# EAGLE design ESP_Module_No_Battery (EAGLE 9.2.0)
COMPANY: ADAFRUIT INDUSTRIES; DRAWN: KTOWN; REV: B
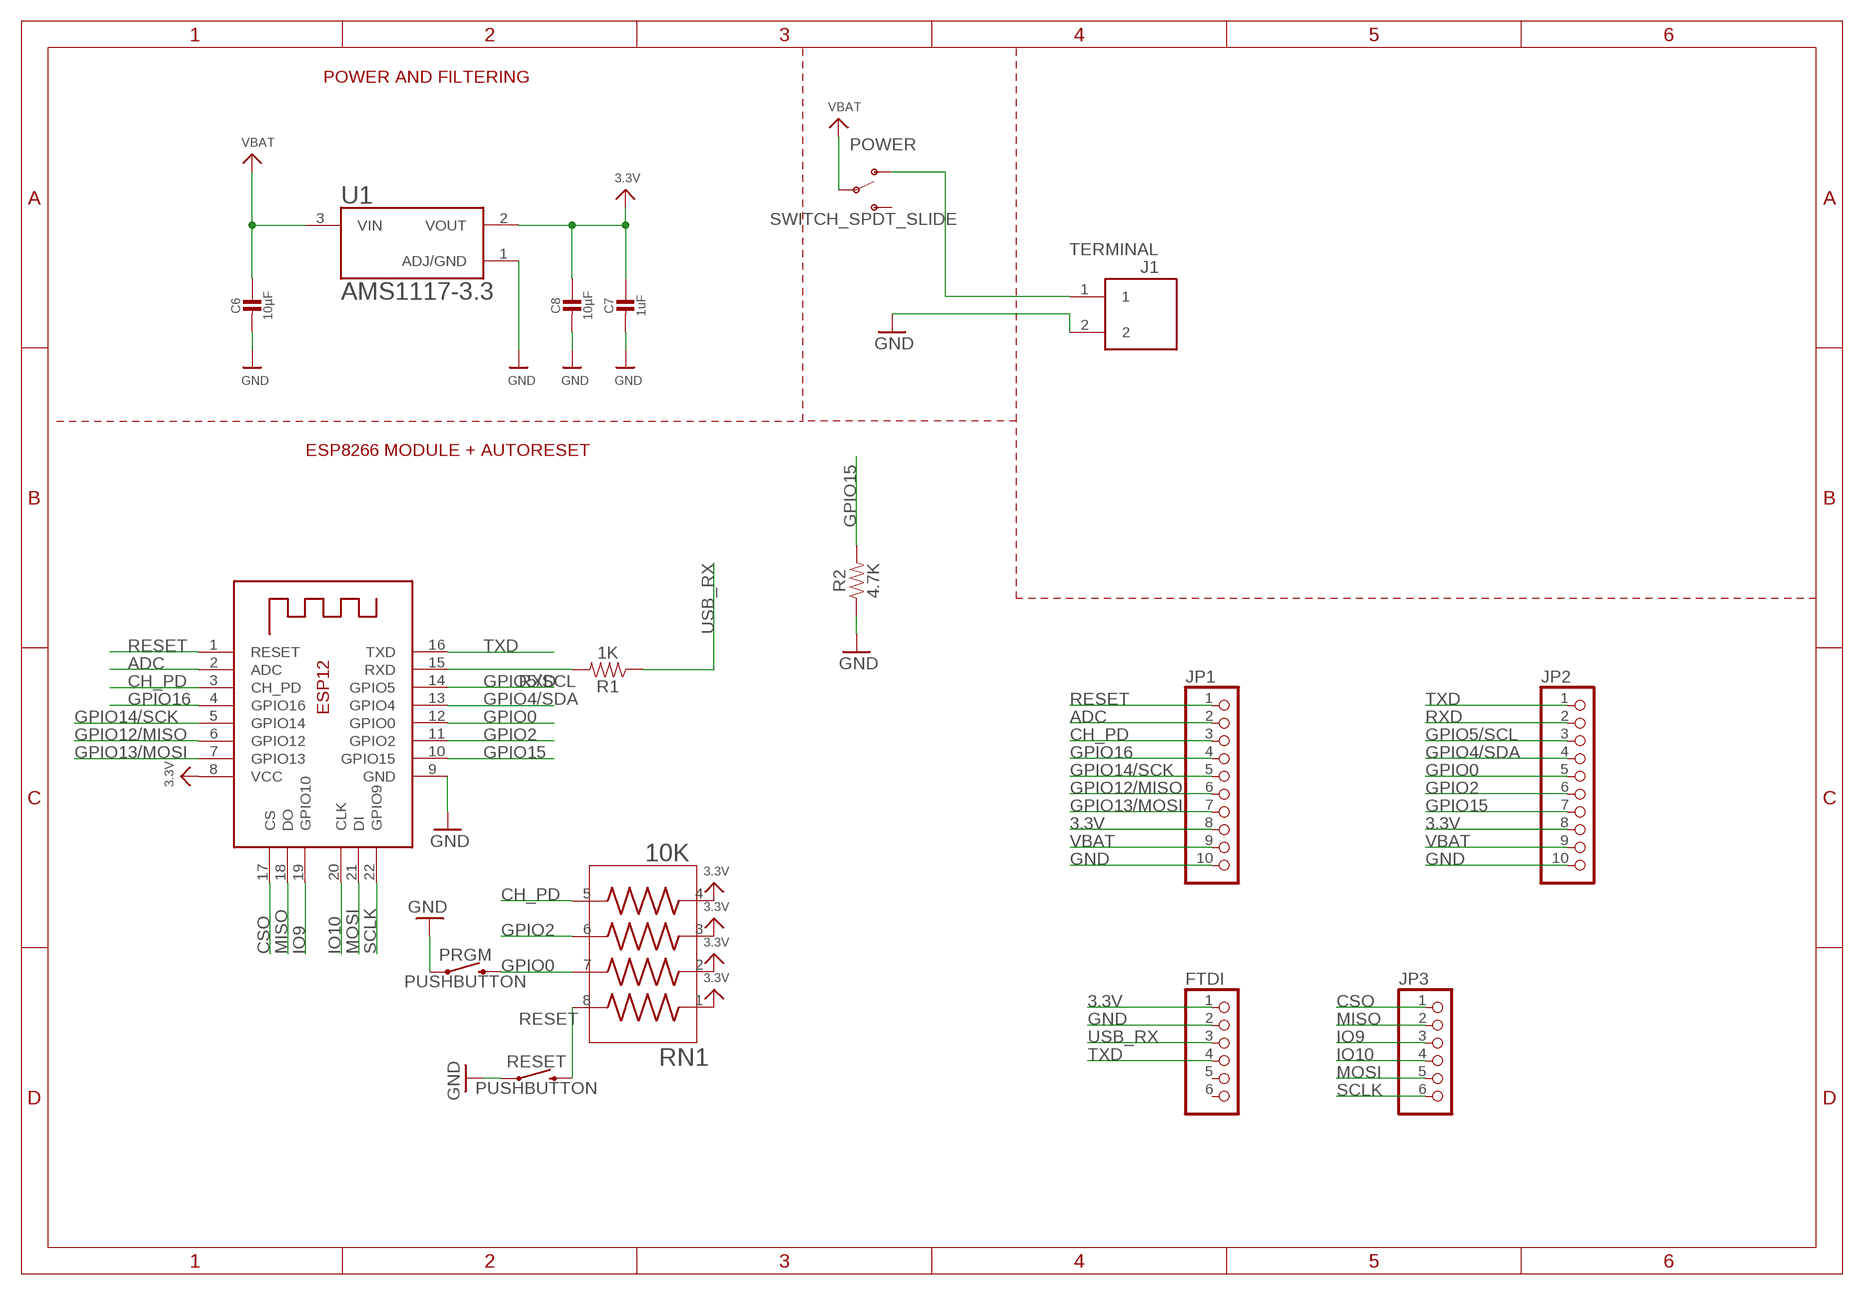
[diagram p0: schematic, sheet 1]

## Parts
C6  10µF  CAP_CERAMIC0805-NOOUTLINE  [0805-NO]
C7  1uF  CAP_CERAMIC0603_NO  [0603-NO]
C8  10µF  CAP_CERAMIC0805-NOOUTLINE  [0805-NO]
FTDI  PINHD-1X6  [1X06]
J1  TERMINAL  [ED555/2DS]
JP1  PINHD-1X10  [1X10]
JP2  PINHD-1X10  [1X10]
JP3  PINHD-1X6  [1X06]
POWER  SWITCH_SPDT_SLIDE  [SWITCH_SPDT_PTH_11.6X4.0MM]
PRGM  PUSHBUTTON  [TACTILE_SWITCH_SMD_6.0X3.5MM]
R1  1K  RESISTOR1206  [1206]
R2  4.7K  RESISTOR1206  [1206]
RESET  PUSHBUTTON  [TACTILE_SWITCH_SMD_6.0X3.5MM]
RN1  10K  CAY16-750J4LF  [RESCAF80P320X160X60-8N]
U1  AMS1117-3.3  [SOT229P700X180-4N]
X2  ESP-12  ESP-12E  [ESP-12E]

## Nets
3.3V: C7.1 C8.1 FTDI.1 JP1.8 JP2.8 RN1.1 RN1.2 RN1.3 RN1.4 U1.2(VOUT) X2.8(VCC)
ADC: JP1.2 X2.2(ADC)
CH_PD: JP1.3 RN1.5 X2.3(CH_PD)
CSO: JP3.1 X2.17(CS)
GND: C6.2 C7.2 C8.2 FTDI.2 J1.2 JP1.10 JP2.10 PRGM.1 R2.1 RESET.1 U1.1(ADJ/GND) X2.9(GND)
GPIO0: JP2.5 PRGM.2 RN1.7 X2.12(GPIO0)
GPIO2: JP2.6 RN1.6 X2.11(GPIO2)
GPIO4/SDA: JP2.4 X2.13(GPIO4)
GPIO5/SCL: JP2.3 X2.14(GPIO5)
GPIO12/MISO: JP1.6 X2.6(GPIO12)
GPIO13/MOSI: JP1.7 X2.7(GPIO13)
GPIO14/SCK: JP1.5 X2.5(GPIO14)
GPIO15: JP2.7 R2.2 X2.10(GPIO15)
GPIO16: JP1.4 X2.4(GPIO16)
IO9: JP3.3 X2.19(GPIO10)
IO10: JP3.4 X2.20(CLK)
MISO: JP3.2 X2.18(DO)
MOSI: JP3.5 X2.21(DI)
N$1: J1.1 POWER.1(O)
RESET: JP1.1 RESET.2 RN1.8 X2.1(RESET)
RXD: JP2.2 R1.2 X2.15(RXD)
SCLK: JP3.6 X2.22(GPIO9)
TXD: FTDI.4 JP2.1 X2.16(TXD)
USB_RX: FTDI.3 R1.1
VBAT: C6.1 JP1.9 JP2.9 POWER.2(P) U1.3(VIN)
Unconnected: FTDI.5 FTDI.6 POWER.3(S)

## Notes on the sheet
- POWER AND FILTERING
- ESP8266 MODULE + AUTORESET

## Library data of the parts
C6-C8 = microbuilder:CAP_CERAMIC: Ceramic Capacitors For new designs, use the packages preceded by an '_' character since they are more reliable: The following footprints should be used on most boards: _0402 - Standard footprint for regular board layouts _0603 - Standard footprint for regular board layouts _0805 - Standard footprint for regular board layouts _1206 - Standard footprint for regular board layouts For extremely tight-pitch boards where space is at a premium, the following 'micro-pitch' footprints can be used (smaller pads, no silkscreen outline, etc.): _0402MP - Micro-pitch footprint for very dense/compact boards _0603MP - Micro-pitch footprint for very dense/compact boards _0805MP - Micro-pitch footprint for very dense/compact boards _1206MP - Micro-pitch footprint for very dense/compact boards
FTDI JP3 = pinhead:PINHD-1X6: PIN HEADER
J1 = AutoPark:TERMINAL: 2-Pin Terminal Block 3.5mm pitch 6A
JP1 JP2 = pinhead:PINHD-1X10: PIN HEADER
POWER = AutoPark:SWITCH_SPDT_SLIDE: 拨动开关SK12D07VG2/3/4/5/6 侧面5脚拨动带支架 3脚2档柄高6MM Taobao <https://item.taobao.com/item.htm?spm=a1z09.2.0.0.53a62e8d0RVocC&id=563254128682&_u=s1po4ce26496> Dimensional Drawing <https://img.alicdn.com/imgextra/i1/2744920356/TB2568GkMDD8KJjy0FdXXcjvXXa_!!2744920356.jpg>
PRGM RESET = AutoPark:PUSHBUTTON
R1 R2 = SparkFun-Resistors:RESISTOR: Generic Resistor Package
RN1 = AutoPark:CAY16-750J4LF: Res Thick Film Array 75 Ohm 5% 0.25W(1/4W) ?200ppm/C ISOL Molded 8-Pin 1206(4 X 0603) Convex SMD T/R; AVAILABILITY: Unavailable; DESCRIPTION: Res Thick Film Array 75 Ohm 5% 0.25W_1/4W_ ?200ppm/C ISOL Molded 8-Pin 1206_4 X 0603_ Convex SMD T/R; MF: Bourns; MP: CAY16-750J4LF; PACKAGE: 1206 Bourns; PRICE: None
U1 = AutoPark:AMS1117-3.3: Sot223/Pkg 1-Amp 3.3-Volt Low Drop Out Voltage Regulatator; AVAILABILITY: Unavailable; DESCRIPTION: Sot223/Pkg 1-Amp 3.3-Volt Low Drop Out Voltage Regulatator; MF: Advanced Monolithic Systems; MP: AMS1117-3.3; PACKAGE: None; PRICE: None
X2 = microbuilder:ESP-12E

## Board
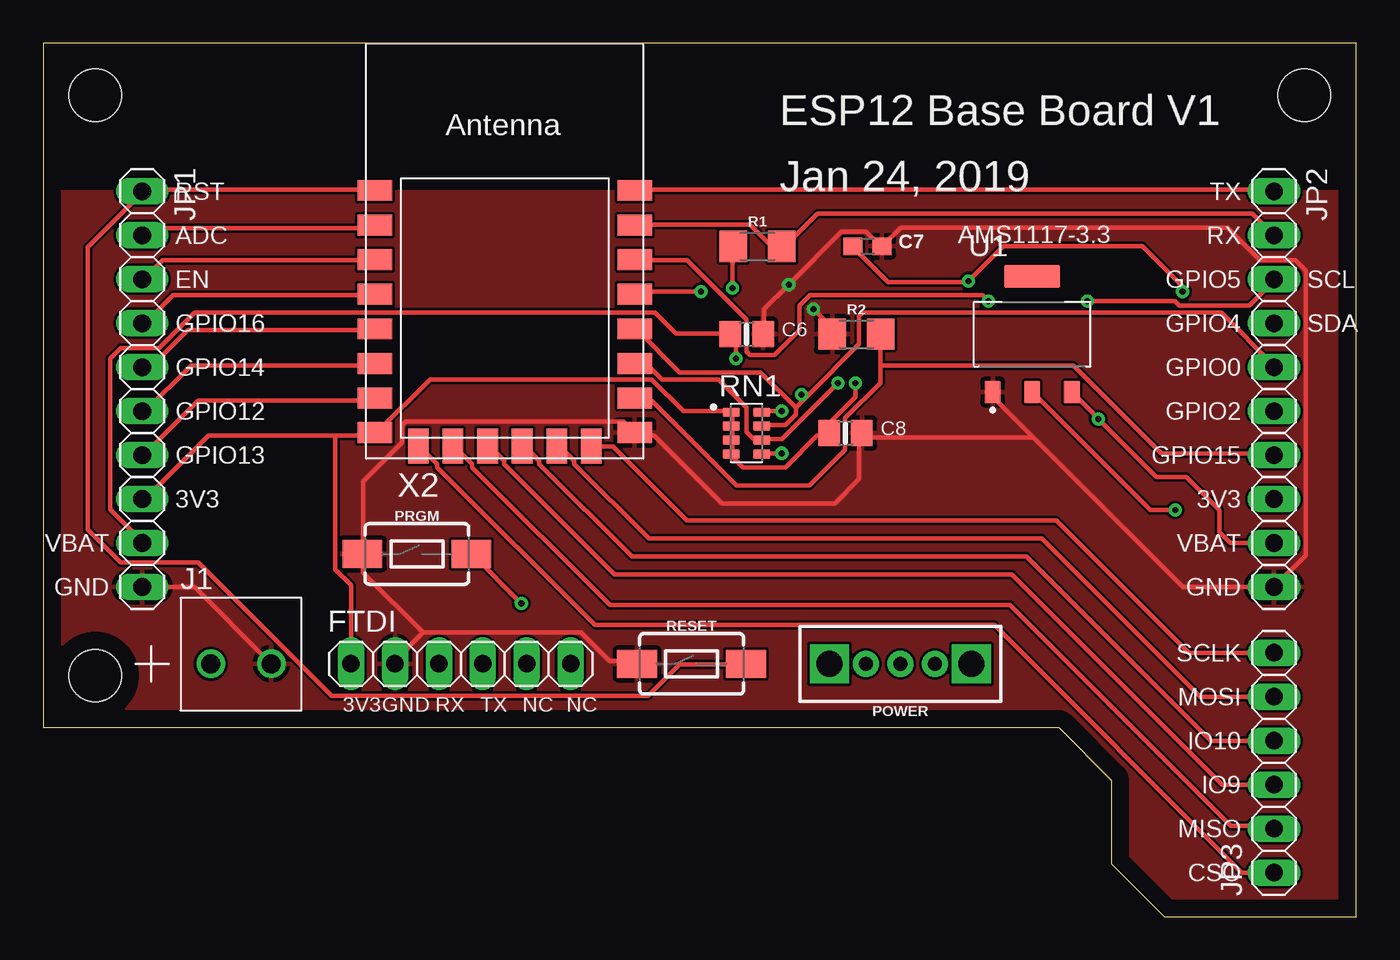
[diagram p1: board, top side]
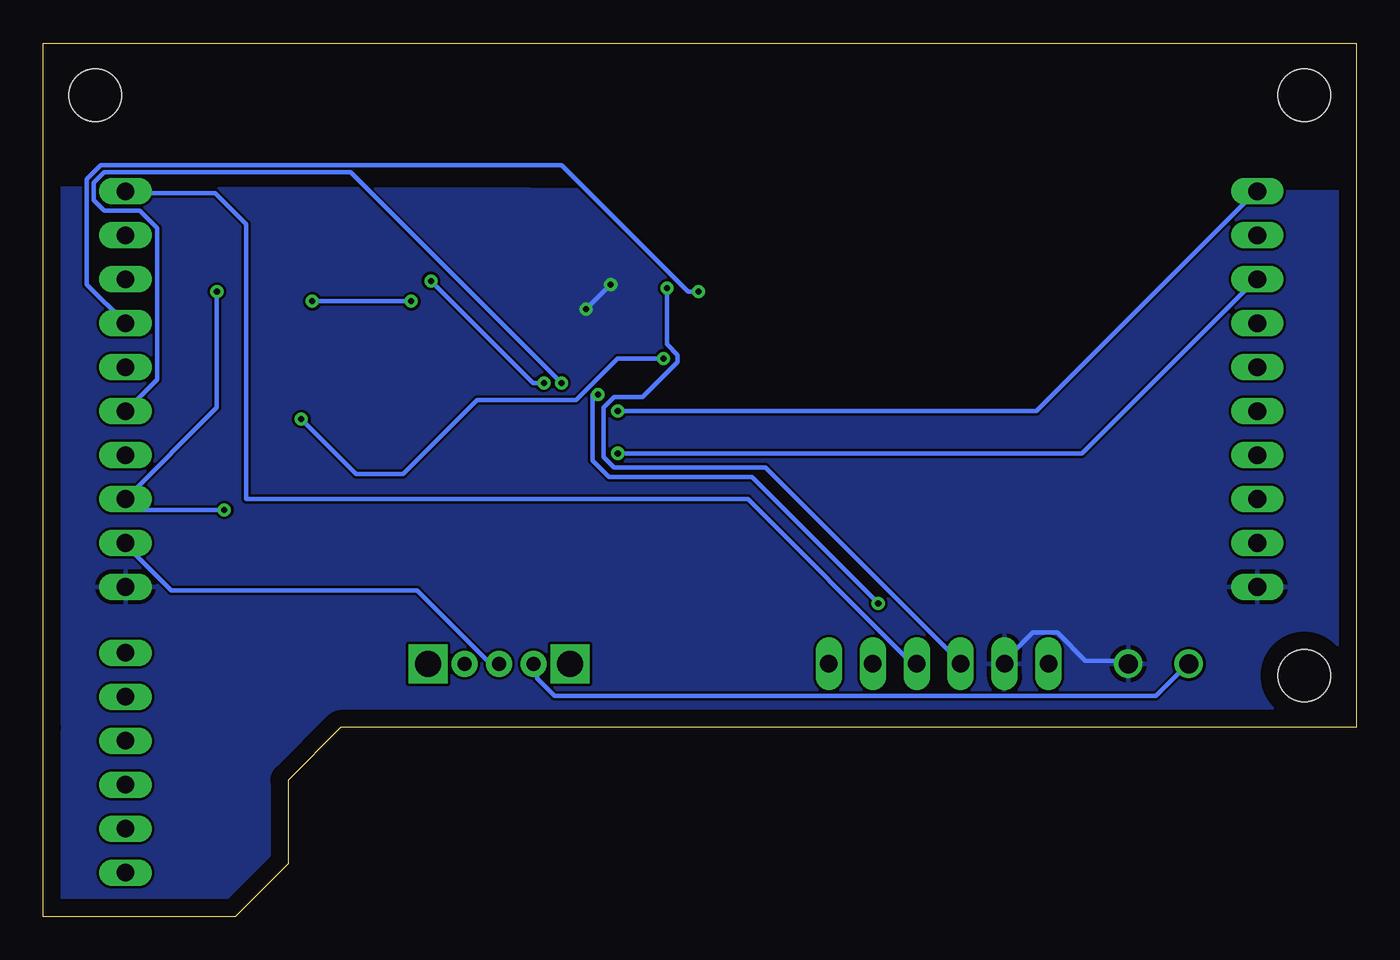
[diagram p2: board, bottom side, seen from below]

Size 75.87 x 50.47 mm. Coordinates in mm from the lower left corner, seen from the top.
Outline: 0,10.92 58.67,10.92 61.72,7.87 61.72,3.05 64.77,0 75.87,0 75.87,10.92 75.87,50.47 0,50.47 0,10.92
Copper layers (1*16): Top 0.035mm / dielectric 1.5mm / Bottom 0.035mm
Design rules "default *": minimum track width 10mil, minimum drill 0.35mm, track to track 6mil, track to pad 6mil, pad to pad 6mil, via to via 6mil, smd to smd 6mil, copper to edge 40mil, drill to drill 6mil, minimum pad ring 10mil, minimum via ring 8mil, stop-mask expansion 4mil, vias tented up to drill 0mil, thermal gap 10mil
Holes 3 mm at 3,13.92 72.87,47.47 3,47.47

### Footprints (pad centres in the part's own frame; a part is rotated, then mirrored left to right if it is on the bottom)
0805-NO = smd 1.24 x 1.5: 1 -0.95,0; 2 0.95,0
0603-NO = smd 1.1 x 1: 1 -0.85,0; 2 0.85,0
1X06 = drill 1.016 long: 1 -6.35,0; 2 -3.81,0; 3 -1.27,0; 4 1.27,0; 5 3.81,0; 6 6.35,0
ED555/2DS = drill 1.1: 1 -1.75,0; 2 1.75,0
1X10 = drill 1.016 long: 1 -11.43,0; 2 -8.89,0; 3 -6.35,0; 4 -3.81,0; 5 -1.27,0; 6 1.27,0; 7 3.81,0; 8 6.35,0; 9 8.89,0; 10 11.43,0
SWITCH_SPDT_PTH_11.6X4.0MM = drill 0.8 pad 1.5: 1 0,2; 2 0,0; 3 0,-2 | drill 1.5 pad 1.8 square: P$1 0,-4.1; P$2 0,4.1
TACTILE_SWITCH_SMD_6.0X3.5MM = smd 2.3 x 1.6: 1 -3.15,0; 2 3.15,0
1206 = smd 1.6 x 1.8: 1 -1.4,0; 2 1.4,0
RESCAF80P320X160X60-8N = smd 0.97 x 0.53: 1 -0.875,1.2; 2 -0.875,0.4; 3 -0.875,-0.4; 4 -0.875,-1.2; 5 0.875,-1.2; 6 0.875,-0.4; 7 0.875,0.4; 8 0.875,1.2
SOT229P700X180-4N = smd 0.93 x 1.31: 1 -2.29,-3.345; 2 0,-3.345; 3 2.29,-3.345 | smd 3.24 x 1.31: 4 0,3.345
ESP-12E = smd 2 x 1.2: 1 -7.5,5.77; 2 -7.5,3.77; 3 -7.5,1.77; 4 -7.5,-0.23; 5 -7.5,-2.23; 6 -7.5,-4.23; 7 -7.5,-6.23; 8 -7.5,-8.23; 9 7.5,-8.23; 10 7.5,-6.23; 11 7.5,-4.23; 12 7.5,-2.23; 13 7.5,-0.23; 14 7.5,1.77; 15 7.5,3.77; 16 7.5,5.77 | smd 1.2 x 2: 17 -5,-9; 18 -3,-9; 19 -1,-9; 20 1,-9; 21 3,-9; 22 5,-9

### Placement (x,y rotation side)
C6  40.64,33.66 0 top
C7  47.62,38.73 0 top
C8  46.35,27.94 0 top
FTDI  24.13,14.61 0 top
J1  11.43,14.61 0 top
JP1  5.71,30.48 270 top
JP2  71.12,30.48 270 top
JP3  71.12,8.89 90 top
POWER  49.53,14.61 90 top
PRGM  21.59,20.96 0 top
R1  41.27,38.73 0 top
R2  46.99,33.66 0 top
RESET  37.47,14.61 0 top
RN1  40.64,27.94 0 top
U1  57.15,33.66 0 top
X2  26.67,36.19 0 top

### Tracks (layer width: path | path; a pad name or v marks a point on that pad's centre or on a via)
3.3V  (via drill 0.35)
  Top 0.254: C7.1 46.94,38.56 48.82,36.68 53.42,36.68 v53.47,36.73 55.47,38.73 63.5,38.73 65.84,36.4 v65.84,36.12 | 16.87,27.79 9.55,27.79 5.89,24.13 JP1.8 | 16.87,27.79 19.1,27.79 X2.8 19.3,27.99 22.35,31.04 35.15,31.04 36.98,29.21 39.62,29.21 RN1.1 39.83,29.01 39.83,28.4 RN1.2 39.83,28.19 39.83,27.58 RN1.3 39.83,27.38 39.83,26.77 RN1.4 39.83,26.57 40.44,25.96 42.88,25.96 44.7,27.79 45.31,27.79 C8.1 45.52,27.99 45.52,28.6 46.94,30.02 v46.94,30.84 | U1.2 63.97,23.5 v65.41,23.5 | 16.87,27.79 16.87,20.07 17.78,19.15 FTDI.1
  Bottom 0.254: v65.84,36.12 65.84,29.41 JP2.8 70.48,23.5 v65.41,23.5 | v53.47,36.73 47.57,30.84 v46.94,30.84
ADC
  Top 0.254: X2.2 19.1,39.78 6.3,39.78 5.89,39.37 JP1.2
CH_PD  (via drill 0.35)
  Top 0.254: v42.67,26.77 41.66,26.77 RN1.5 | X2.3 19.1,37.95 6.91,37.95 5.89,36.93 JP1.3
  Bottom 0.254: v42.67,26.77 15.85,26.77 5.89,36.73 JP1.3
CSO
  Top 0.254: JP3.1 69.27,2.54 54.97,16.84 31.88,16.84 22.76,25.96 22.76,26.16 21.74,27.18 X2.17
GND  (via drill 0.35)
  Top 0.254: C6.2 41.66,33.68 41.66,35.1 v43.08,36.53 46.13,39.57 47.55,39.57 48.36,38.76 C7.2 49.57,39.83 68.43,39.83 70.31,37.95 72.34,37.95 72.95,37.34 72.95,20.88 JP2.10 65.84,19.05 57.2,27.69 | v44.5,35.1 45.52,34.09 45.52,33.68 R2.1 | 57.2,27.69 47.56,27.69 C8.2 47.14,27.79 47.14,25.27 45.74,23.88 39.22,23.88 35.31,27.79 34.34,27.79 X2.9 34.14,27.99 33.53,28.6 20.93,28.6 20.73,28.4 20.73,27.38 18.49,25.15 18.49,21.08 PRGM.1 18.49,20.88 18.49,19.86 21.95,16.41 | 57.2,27.69 54.66,30.23 U1.1 | JP1.10 8.74,19.05 13.01,14.78 J1.2 | 21.95,16.41 31.09,16.41 32.72,14.78 34.14,14.78 RESET.1 | 21.95,16.41 20.32,14.78 FTDI.2
  Bottom 0.254: v43.08,36.53 v44.5,35.1 | J1.2 13.21,14.78 15.65,14.78 17.27,16.41 18.69,16.41 20.32,14.78 FTDI.2
  pour Top: 0.25,41.91 76.33,41.91 76.33,0 76.2,0 64.9,0 61.72,3.05 61.72,7.75 58.67,10.79 0.13,10.79 0.13,41.91
  pour Bottom: 0.25,41.91 0.25,10.79 58.55,10.92 61.98,7.87 61.98,2.92 64.52,0.25 76.07,0.13 76.07,42.16 0.51,41.91
GPIO0  (via drill 0.35)
  Top 0.254: 43.48,29.41 43.48,29.01 42.88,28.4 41.66,28.4 RN1.7 | 43.48,29.41 41.45,31.44 36.78,31.44 34.34,33.88 X2.12 | 44.18,30.11 47.14,33.07 47.14,34.7 47.35,34.9 68.07,34.9 71.12,31.85 JP2.5 | 44.18,30.11 43.48,29.41 | v27.62,18.1 24.77,20.96 PRGM.2 | v43.81,30.16 44.13,30.16 44.18,30.11
  Bottom 0.254: v27.62,18.1 34.92,25.4 43.18,25.4 44.13,26.35 44.13,30.16 v43.81,30.16
GPIO2  (via drill 0.35)
  Top 0.254: X2.11 34.34,31.85 34.95,31.85 35.76,31.04 39.01,31.04 40.64,29.41 40.64,27.99 41.05,27.58 41.45,27.58 RN1.6 41.66,27.58 42.67,27.58 v45.92,30.84
  Bottom 0.254: JP2.6 69.29,31.04 69.29,39.78 70.31,40.79 72.34,40.79 72.95,41.4 72.95,42.42 72.34,43.03 58.12,43.03 v45.92,30.84
GPIO4/SDA  (via drill 0.35)
  Top 0.254: v38,36.12 34.34,36.12 X2.13
  Bottom 0.254: v38,36.12 38.61,36.12 45.92,43.43 72.54,43.43 73.36,42.62 73.36,36.53 JP2.4
GPIO5/SCL  (via drill 0.35)
  Top 0.254: X2.14 34.34,37.95 37.19,37.95 40.64,34.49 40.64,32.66 40.84,32.46 42.27,32.46 43.69,33.88 43.69,35.31 44.3,35.92 54.25,35.92 v54.61,35.56 | JP2.3 71.12,36.73 69.7,35.31 65.63,35.31 65.38,35.56 v60.33,35.56
  Bottom 0.254: v60.33,35.56 v54.61,35.56
GPIO12/MISO
  Top 0.254: X2.6 19.1,31.85 8.53,31.85 5.89,29.21 JP1.6
GPIO13/MOSI
  Top 0.254: X2.7 19.1,29.82 8.94,29.82 5.89,26.77 JP1.7
GPIO14/SCK
  Top 0.254: X2.5 19.1,33.88 8.33,33.88 6.3,31.85 5.89,31.85 JP1.5
GPIO15
  Top 0.254: 48.36,31.85 48.36,30.84 46.33,28.8 46.33,26.97 44.27,24.92 40.06,24.92 35.15,29.82 34.34,29.82 X2.10 | 48.36,31.85 48.36,33.48 R2.2 | 48.36,31.85 59.54,31.85 64.62,26.77 71.12,26.77 JP2.7
GPIO16
  Top 0.254: X2.4 19.1,35.92 7.52,35.92 5.89,34.29 JP1.4
IO9
  Top 0.254: JP3.3 68.12,7.62 55.98,19.76 33.02,19.76 26.62,26.16 26.62,26.36 25.81,27.18 X2.19
IO10
  Top 0.254: JP3.4 67.46,10.16 56.82,20.8 34.01,20.8 28.65,26.16 28.65,26.36 27.84,27.18 X2.20
MISO
  Top 0.254: X2.18 23.77,27.18 24.79,26.16 24.79,25.96 32.74,18.01 55.85,18.01 68.63,5.23 71.12,5.23 JP3.2
MOSI
  Top 0.254: JP3.5 66.85,12.7 57.71,21.84 35,21.84 30.68,26.16 30.68,26.36 29.87,27.18 X2.21
N$1
  Bottom 0.254: POWER.1 47.35,14.58 47.35,13.77 46.33,12.75 11.58,12.75 9.75,14.58 J1.1
RESET  (via drill 0.35)
  Top 0.254: v42.67,29.21 41.66,29.21 RN1.8 | X2.1 19.1,42.01 5.89,42.01 JP1.1 5.69,41.81 2.56,38.68 2.56,22.38 4.47,20.47 8.94,20.47 16.66,12.75 34.95,12.75 36.78,14.58 40.44,14.58 RESET.2
  Bottom 0.254: v42.67,29.21 18.49,29.21 5.89,41.81 JP1.1
RXD
  Top 0.254: X2.15 34.34,39.98 40.84,39.98 42.06,38.76 42.67,38.76 R1.2 42.88,38.76 44.73,40.61 69.88,40.61 JP2.2
SCLK
  Top 0.254: JP3.6 66.19,15.24 58.55,22.89 37.21,22.89 32.92,27.18 31.7,27.18 X2.22
TXD
  Top 0.254: X2.16 34.34,42.01 71.12,42.01 JP2.1
  Bottom 0.254: JP2.1 71.12,41.81 65.94,41.81 64.14,40 64.14,24.13 35.15,24.13 25.81,14.78 25.4,14.78 FTDI.4
USB_RX  (via drill 0.35)
  Top 0.254: v39.83,36.32 39.83,38.56 R1.1
  Bottom 0.254: v39.83,36.32 39.83,33.07 39.22,32.46 39.22,32.06 41.25,30.02 42.88,30.02 43.48,29.41 43.48,26.57 42.88,25.96 34.14,25.96 22.96,14.78 FTDI.3
VBAT  (via drill 0.35)
  Top 0.254: JP1.9 5.69,21.69 3.86,23.52 3.86,32.26 4.47,32.87 6.71,32.87 8.74,34.9 35.36,34.9 36.58,33.68 39.62,33.68 C6.1 39.83,33.48 40.03,33.27 v40.03,32.26 | U1.3 60.96,28.79 v60.96,28.75 64.31,25.4 66.04,25.4 67.94,23.5 67.94,22.22 68.58,21.59 JP2.9
  Bottom 0.254: v60.96,28.75 57.78,25.58 55.07,25.58 50.8,29.85 45.09,29.85 42.67,32.26 v40.03,32.26 | POWER.2 49.58,14.78 50.19,14.78 54.25,18.85 68.48,18.85 71.12,21.49 JP2.9

### Text on the board
tPlace: ESP12 Base Board V1 | RST | Jan 24, 2019 | TX | ADC | RX | EN | GPIO5 | SCL | GPIO16 | GPIO4 | SDA | GPIO14 | GPIO0 | GPIO12 | GPIO2 | GPIO13 | GPIO15 | 3V3 | 3V3 | VBAT | VBAT | GND | GND | SCLK | 3V3 | GND | RX | TX | NC | NC | MOSI | IO10 | IO9 | MISO | CSO